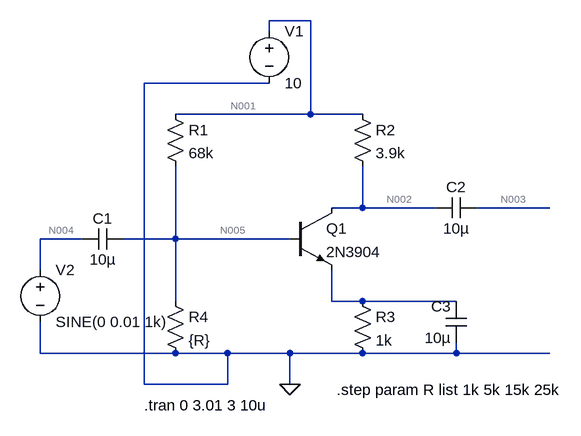
[diagram p0: schematic Lab6Pre2.asc]
Lab6Pre2.asc, the LTspice schematic file:
Version 4
SHEET 1 880 680
WIRE 272 -64 208 -64
WIRE 208 -48 208 -64
WIRE 208 32 16 32
WIRE 272 80 272 -64
WIRE 272 80 64 80
WIRE 352 80 272 80
WIRE 352 224 352 160
WIRE 352 224 304 224
WIRE 464 224 352 224
WIRE 640 224 528 224
WIRE -80 272 -144 272
WIRE 64 272 64 160
WIRE 64 272 -16 272
WIRE 240 272 64 272
WIRE -144 320 -144 272
WIRE 64 368 64 272
WIRE 304 368 304 320
WIRE 352 368 304 368
WIRE 496 368 352 368
WIRE -144 448 -144 400
WIRE 64 448 -144 448
WIRE 144 448 64 448
WIRE 240 448 144 448
WIRE 352 448 240 448
WIRE 496 448 496 432
WIRE 496 448 352 448
WIRE 640 448 496 448
WIRE 16 496 16 32
WIRE 144 496 144 448
WIRE 144 496 16 496
WIRE 240 496 240 448
FLAG 240 496 0
SYMBOL res 48 64 R0
SYMATTR InstName R1
SYMATTR Value 68k
SYMBOL res 336 64 R0
SYMATTR InstName R2
SYMATTR Value 3.9k
SYMBOL res 336 352 R0
SYMATTR InstName R3
SYMATTR Value 1k
SYMBOL res 48 352 R0
SYMATTR InstName R4
SYMATTR Value {R}
SYMBOL npn 240 224 R0
SYMATTR InstName Q1
SYMATTR Value 2N3904
SYMBOL voltage 208 -64 R0
WINDOW 123 0 0 Left 2
WINDOW 39 0 0 Left 2
SYMATTR InstName V1
SYMATTR Value 10
SYMBOL cap -16 256 R90
WINDOW 0 0 32 VBottom 2
WINDOW 3 32 32 VTop 2
SYMATTR InstName C1
SYMATTR Value 10µ
SYMBOL cap 528 208 R90
WINDOW 0 0 32 VBottom 2
WINDOW 3 32 32 VTop 2
SYMATTR InstName C2
SYMATTR Value 10µ
SYMBOL cap 512 432 R180
WINDOW 0 24 56 Left 2
WINDOW 3 24 8 Left 2
SYMATTR InstName C3
SYMATTR Value 10µ
SYMBOL voltage -144 304 R0
WINDOW 123 0 0 Left 2
WINDOW 39 0 0 Left 2
SYMATTR InstName V2
SYMATTR Value SINE(0 0.01 1k)
TEXT 312 504 Left 2 !.step param R list 1k 5k 15k 25k
TEXT 16 528 Left 2 !.tran 0 3.01 3 10u

The netlist it stands for:
* Lab6Pre2.asc
R1 N001 N005 68k
R2 N001 N002 3.9k
R3 N006 0 1k
R4 N005 0 {R}
Q1 N002 N005 N006 0 2N3904
V1 N001 0 10
C1 N005 N004 10µ
C2 N003 N002 10µ
C3 0 N006 10µ
V2 N004 0 SINE(0 0.01 1k)
.model NPN NPN
.model PNP PNP
.lib standard.bjt
.step param R list 1k 5k 15k 25k
.tran 0 3.01 3 10u
.backanno
.end

* Results of the author's LTspice run, read from the files saved beside the schematic
* Operating Point (first step), zero values left out:
*   r = 1 k
*   V(n001) = 10 V
*   V(n005) = 144.9 mV
*   V(n002) = 10 V
*   V(n003) = 100 µV
*   Ic(Q1) = 12.83 pA
*   Ib(Q1) = -9.704 pA
*   Ie(Q1) = -3.134 pA
*   I(R4) = 144.9 µA
*   I(R3) = 3.134 pA
*   I(R2) = 12.82 pA
*   I(R1) = 144.9 µA
*   I(V1) = -144.9 µA
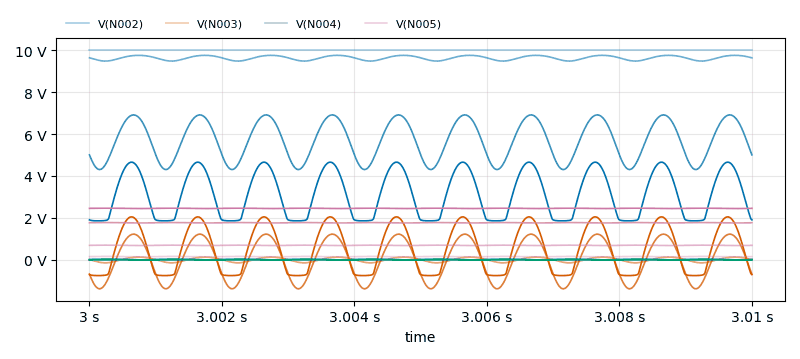
[diagram p1: Transient Analysis of Lab6Pre2.asc, plotted from the saved traces]
* Transient Analysis, 4 runs:
*   V(N002) [r=1000]: min 10 V, max 10 V, average 10 V, rms 10 V, last 10 V
*   V(N002) [r=5000]: min 9.488 V, max 9.762 V, average 9.638 V, rms 9.638 V, last 9.643 V
*   V(N002) [r=15000]: min 4.305 V, max 6.915 V, average 5.696 V, rms 5.77 V, last 5.005 V
*   V(N002) [r=25000]: min 1.853 V, max 4.659 V, average 3.106 V, rms 3.29 V, last 1.9 V
*   V(N003) [r=1000]: min 99.59 µV, max 100.4 µV, average 100 µV, rms 100 µV, last 100.4 µV
*   V(N003) [r=5000]: min -152.8 mV, max 121.4 mV, average -2.739 mV, rms 96.9 mV, last 2.098 mV
*   V(N003) [r=15000]: min -1.392 V, max 1.217 V, average -1.692 mV, rms 923.1 mV, last -692.1 mV
*   V(N003) [r=25000]: min -761.3 mV, max 2.045 V, average 492.5 mV, rms 1.189 V, last -714 mV
*   V(N004) [r=1000]: min -9.985 mV, max 9.985 mV, average -1.676 nV, rms 7.064 mV, last 0 V
*   V(N004) [r=5000]: min -9.985 mV, max 9.985 mV, average 222.2 nV, rms 7.063 mV, last 0 V
*   V(N004) [r=15000]: min -9.985 mV, max 9.985 mV, average -79.19 nV, rms 7.064 mV, last 0 V
*   V(N004) [r=25000]: min -9.987 mV, max 9.99 mV, average 2.174 µV, rms 7.065 mV, last 0 V
*   V(N005) [r=1000]: min 135 mV, max 154.9 mV, average 144.9 mV, rms 145.1 mV, last 145.1 mV
*   V(N005) [r=5000]: min 673.6 mV, max 693.6 mV, average 683.6 mV, rms 683.6 mV, last 683.6 mV
*   V(N005) [r=15000]: min 1.754 V, max 1.773 V, average 1.764 V, rms 1.764 V, last 1.764 V
*   V(N005) [r=25000]: min 2.441 V, max 2.46 V, average 2.451 V, rms 2.451 V, last 2.451 V